# Altium project DIOT_EEM_Adapter.PrjPCB (part 1 of 2)
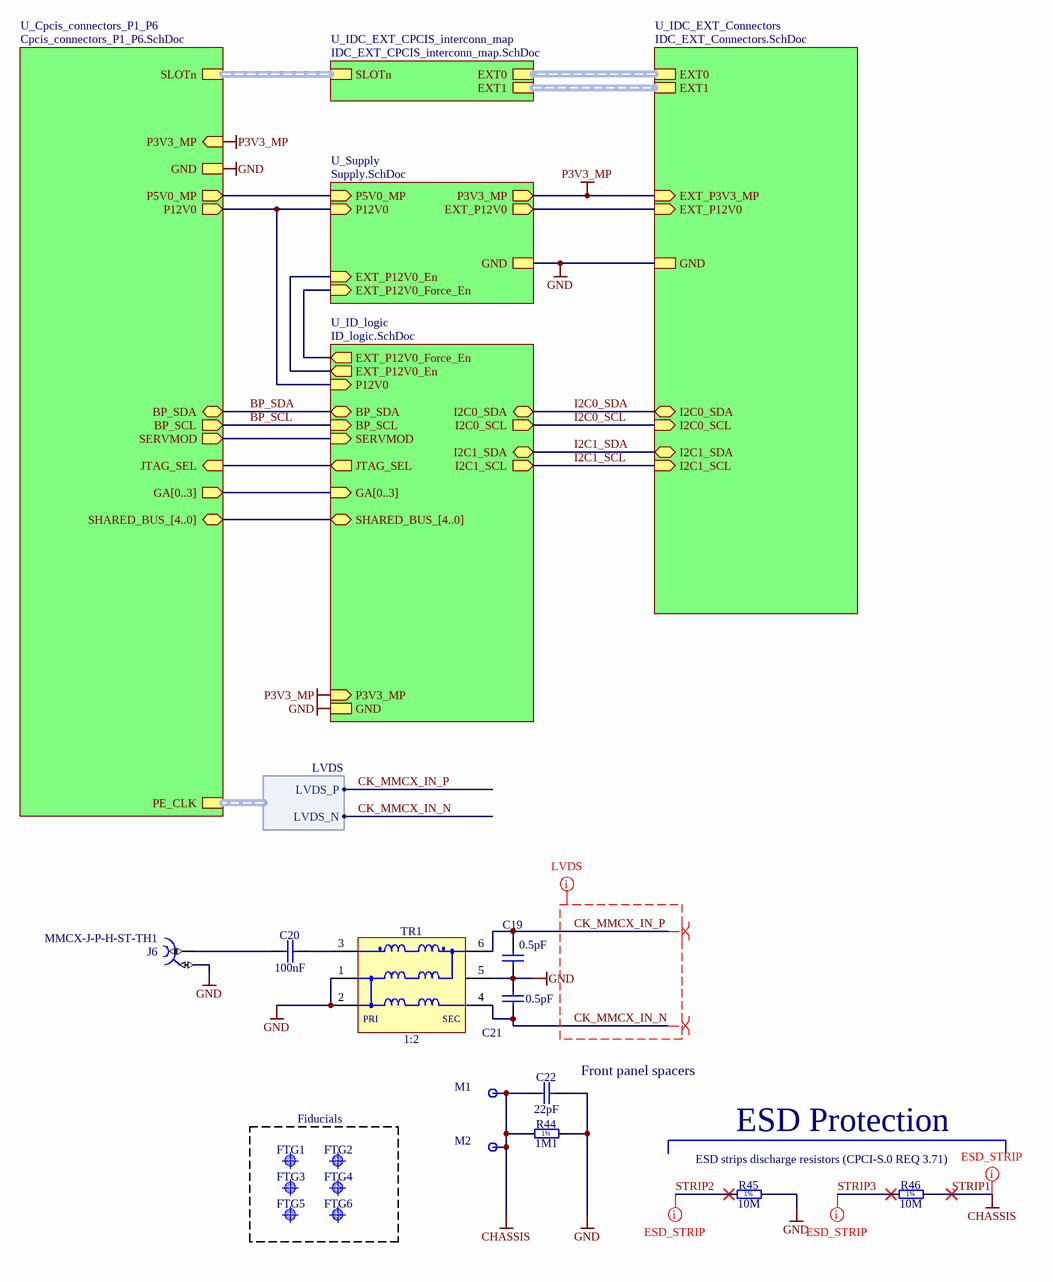
[diagram p0: DIOT_EEM_Adapter.SchDoc]
Address1: Warsaw University of Technology; Address2: Nowowiejska 15/19 00-665 Warsaw; Address3: -; CheckedBy: -; CheckedDate: -; Designer: Marcin Kiepiela; DivGrp: ISE; DrawnBy: Marcin Kiepiela; Project1: DIOT_EEM_Adapter; Projet: ARTIQ/Sinara/DIOT; SheetTotal: 6; Title: DIOT_EEM_Adapter; Version: 1.0
6 sheets, 144 parts. Net scope: strictly hierarchical (ports join the sheet entries above them; power ports are local).
Board file: DIOT_EEM_Adapter.pcbdoc
Sheets:
  DIOT_EEM_Adapter.SchDoc
    U_ID_logic = ID_logic.SchDoc
    U_IDC_EXT_Connectors = IDC_EXT_Connectors.SchDoc
    U_Cpcis_connectors_P1_P6 = Cpcis_connectors_P1_P6.SchDoc
    U_Supply = Supply.SchDoc
    U_IDC_EXT_CPCIS_interconn_map = IDC_EXT_CPCIS_interconn_map.SchDoc

## Sheet DIOT_EEM_Adapter.SchDoc: DIOT_EEM_Adapter
size 420 x 297 mm; CheckedBy: -; DrawnBy: Marcin Kiepiela; Address1: Warsaw University of Technology; Address2: Nowowiejska 15/19 00-665 Warsaw; DocumentNumber: 1; SheetNumber: 1; SheetTotal: 6; EDA_Number: ARTIQ; Projet: ARTIQ/Sinara/DIOT; ModifiedBy: -; CheckedDate: -; Title2: -; DivGrp: ISE; Designer: Marcin Kiepiela; ModifiedDate: -; ProjectName: DIOT_EEM_Adapter.PrjPCB

### Parts
C19  0.5pF  [CAPC1005X50N]
C20  100nF  [CAPC1005X55N]
C21  0.5pF  [CAPC1005X50N]
C22  22pF  [CAPC1005X55N]
FTG1  Use only in PCB  [FIDUCIAL_TOP_S100-200]  (value not drawn)  (no BOM)
FTG2  Use only in PCB  [FIDUCIAL_TOP_S100-200]  (value not drawn)  (no BOM)
FTG3  Use only in PCB  [FIDUCIAL_TOP_S100-200]  (value not drawn)  (no BOM)
FTG4  Use only in PCB  [FIDUCIAL_TOP_S100-200]  (value not drawn)  (no BOM)
FTG5  Use only in PCB  [FIDUCIAL_TOP_S100-200]  (value not drawn)  (no BOM)
FTG6  Use only in PCB  [FIDUCIAL_TOP_S100-200]  (value not drawn)  (no BOM)
J6  MMCX-J-P-H-ST-TH1  [SAMTEC_MMCX-J-P-H-ST-TH1]
M1  Plated Hole  [MTG300_600]  (value not drawn)  (no BOM)
M2  Plated Hole  [MTG300_600]  (value not drawn)  (no BOM)
R44  1M1  [RESC2012X60N]
R45  10M  [RESC2113X55N]
R46  10M  [RESC2113X55N]
TR1  1:2  [XFMR_MINI-CIRCUITS_DB1627]

### Blocks framed on the sheet
Fiducials: FTG1-FTG6

### Sub-sheets
U_Cpcis_connectors_P1_P6 = Cpcis_connectors_P1_P6.SchDoc: SLOTn (harness SLOT), BP_SDA (bidir), BP_SCL (out), SHARED_BUS_[4..0] (bidir), GND, P5V0_MP (out), P12V0 (out), PE_CLK (harness LVDS), GA[0..3] (out), P3V3_MP (in), JTAG_SEL (in), SERVMOD (out)
U_ID_logic = ID_logic.SchDoc: BP_SCL (in), BP_SDA (bidir), I2C0_SDA (bidir), I2C0_SCL (out), I2C1_SDA (bidir), I2C1_SCL (out), GND, P3V3_MP (in), GA[0..3] (in), JTAG_SEL (out), EXT_P12V0_En (out), SERVMOD (in), EXT_P12V0_Force_En (out), P12V0 (in), SHARED_BUS_[4..0] (bidir)
U_IDC_EXT_Connectors = IDC_EXT_Connectors.SchDoc: EXT0 (harness ExtensionConnector), EXT1 (harness ExtensionConnector), I2C0_SDA (bidir), I2C0_SCL (in), I2C1_SDA (bidir), I2C1_SCL (in), EXT_P12V0 (in), EXT_P3V3_MP (in), GND
U_IDC_EXT_CPCIS_interconn_map = IDC_EXT_CPCIS_interconn_map.SchDoc: EXT0 (harness ExtensionConnector), EXT1 (harness ExtensionConnector), SLOTn (harness SLOT)
U_Supply = Supply.SchDoc: EXT_P12V0 (out), P3V3_MP (out), GND, P5V0_MP (in), P12V0 (in), EXT_P12V0_En (in), EXT_P12V0_Force_En (in)

### Harnesses
LVDS: LVDS_P, LVDS_N

### Nets
CHASSIS: C22.1 M1.1 M2.1 R44.1 R46.2  [also labelled STRIP1]
EXT_P12V0: sheet U_IDC_EXT_Connectors/EXT_P12V0, sheet U_Supply/EXT_P12V0
GND: C19.1 C21.2 C22.2 J6.2 R44.2 R45.2 TR1.1(P1) TR1.2(P1) TR1.5(NC) ; sheet U_ID_logic/GND, sheet U_IDC_EXT_Connectors/GND, sheet U_Cpcis_connectors_P1_P6/GND, sheet U_Supply/GND
P3V3_MP: sheet U_ID_logic/P3V3_MP, sheet U_IDC_EXT_Connectors/EXT_P3V3_MP, sheet U_Cpcis_connectors_P1_P6/P3V3_MP, sheet U_Supply/P3V3_MP
P5V0_MP: sheet U_Cpcis_connectors_P1_P6/P5V0_MP, sheet U_Supply/P5V0_MP
P12V0: sheet U_ID_logic/P12V0, sheet U_Cpcis_connectors_P1_P6/P12V0, sheet U_Supply/P12V0
BP_SCL: sheet U_ID_logic/BP_SCL, sheet U_Cpcis_connectors_P1_P6/BP_SCL
BP_SDA: sheet U_ID_logic/BP_SDA, sheet U_Cpcis_connectors_P1_P6/BP_SDA
CK_MMCX_IN_N: C21.1 TR1.4(S1) ; sheet U_Cpcis_connectors_P1_P6/PE_CLK.LVDS_N
CK_MMCX_IN_P: C19.2 TR1.6(S1) ; sheet U_Cpcis_connectors_P1_P6/PE_CLK.LVDS_P
EEM_P12V0_En: sheet U_ID_logic/EXT_P12V0_En, sheet U_Supply/EXT_P12V0_En
EXT_P12V0_Force_En: sheet U_ID_logic/EXT_P12V0_Force_En, sheet U_Supply/EXT_P12V0_Force_En
I2C0_SCL: sheet U_ID_logic/I2C0_SCL, sheet U_IDC_EXT_Connectors/I2C0_SCL
I2C0_SDA: sheet U_ID_logic/I2C0_SDA, sheet U_IDC_EXT_Connectors/I2C0_SDA
I2C1_SCL: sheet U_ID_logic/I2C1_SCL, sheet U_IDC_EXT_Connectors/I2C1_SCL
I2C1_SDA: sheet U_ID_logic/I2C1_SDA, sheet U_IDC_EXT_Connectors/I2C1_SDA
JTAG_SEL: sheet U_ID_logic/JTAG_SEL, sheet U_Cpcis_connectors_P1_P6/JTAG_SEL
SERVMOD: sheet U_ID_logic/SERVMOD, sheet U_Cpcis_connectors_P1_P6/SERVMOD
STRIP2: R45.1  [project net STRIP2_1]
STRIP3: R46.1  [project net STRIP3_1]
NetC20_1: C20.1 J6.1
NetC20_2: C20.2 TR1.3(P1)

### Buses and harness runs
bus sheet U_Cpcis_connectors_P1_P6/GA[0..3] = sheet U_ID_logic/GA[0..3]
bus sheet U_Cpcis_connectors_P1_P6/SHARED_BUS_[4..0] = sheet U_ID_logic/SHARED_BUS_[4..0]
harness sheet U_Cpcis_connectors_P1_P6/SLOTn = sheet U_IDC_EXT_CPCIS_interconn_map/SLOTn
harness sheet U_IDC_EXT_Connectors/EXT0 = sheet U_IDC_EXT_CPCIS_interconn_map/EXT0
harness sheet U_IDC_EXT_Connectors/EXT1 = sheet U_IDC_EXT_CPCIS_interconn_map/EXT1

### Layout directives
differential pair: CK_MMCX_IN_N, CK_MMCX_IN_P
net class LVDS: CK_MMCX_IN_N, CK_MMCX_IN_P
net class ESD_STRIP: CHASSIS, STRIP2_1, STRIP3_1

### Notes on the sheet
- (near C22) Front panel spacers
- ESD strips discharge resistors (CPCI-S.0 REQ 3.71)
- ESD Protection
- Project/Equipment
- Document
- Designer
- Drawn by
- Check.by
- Copyright WUT 2023.
  This document describes Open Hardware and is licensed under the CERN-OHL-W v2
  You may redistribute and modify this documentation and make products using it under the terms of the CERN-OHL-W v2 (https:/cern.ch/cern-ohl). This documentation is distributed WITHOUT ANY EXPRESS OR IMPLIED WARRANTY, INCLUDING OF MERCHANTABILITY, SATISFACTORY QUALITY AND FITNESS FOR A PARTICULAR PURPOSE. Please see the CERN-OHL-W v2 for applicable conditions.
  Source location: https://github.com/sinara-hw/EEM_FMC_Carrier
  As per CERN-OHL-W v2 section 4, should You produce hardware based on these sources, You must maintain the Source Location visible on the silkscreen or top copper for a EEM FMC Carrier PCB or other product you make using this documentation.
- Contact:
- File
- Last Mod.
- Print Date
- Sheet
- Size
- A3
- of
- Rev
- (in symbol R0805_1M1_1%_0.125W_100PPM) 1%
- (in symbol R0805_10M_1%_0.125W_100PPM_VISHAY_CRCW e3) 1%
- (in symbol XFMR_MINI-CIRCUITS_TCM2-43X+) PRI; SEC

### Library data of the parts
C19 C21 = CC0402_0.5PF_25V_0.05PF_AVX_04023J0R5ABSTR: Non-polarised capacitor; Part Description: Thin-Film Chip Capacitors for RF Signal and Power Applications, Accu-P Series; Manufacturer: AVX; Voltage: 25V; Tolerance: ±0.05pF; Part Number: CC0402_0.5PF_25V_0.05PF_AVX_04023J0R5ABSTR; Component Kind: Standard; Component Type: Standard; Pin Count: 2; Value: 0.5pF; Status: None; Manufacturer Part Number: 04023J0R5ABSTR; Case: 0402; Mounted: Yes; Socket: No; SMD: Yes; Sense: No; ComponentHeight: 0.5mm; HelpURL: \\cern.ch\dfs\Applications\Altium\Datasheets\CC0402_AVX_ACCU-P.pdf; Author: CERN DEM JLC; CreateDate: 2017-02-22; LatestRevisionDate: 2017-02-22
C20 = CC0402_100NF_16V_10%_X7R: Non-polarised capacitor; Part Description: SMD Multilayer Chip Ceramic Capacitor; Manufacturer: GENERIC; Manufacturer1 Part Number: GRM155R71C104KA88D; Voltage: 16V; TC: X7R; Tolerance: ±10%; Part Number: CC0402_100NF_16V_10%_X7R; Component Kind: Standard; Component Type: Standard; Pin Count: 2; Value: 100nF; Status: Not Recommended; Manufacturer Part Number: CC0402_100NF_16V_10%_X7R; Case: 0402; Mounted: Yes; Socket: No; SMD: Yes; Sense: No; Manufacturer1 Example: MURATA; Manufacturer1 ComponentHeight: 0.55mm; HelpURL: \\cern.ch\dfs\Applications\Altium\Datasheets\CC0402_X7R_MURATA_GRM.pdf; Author: CERN DEM JLC; CreateDate: 05.12.2013; LatestRevisionDate: 03.12.2007
C22 = CC0402_22PF_50V_5%_C0G: Non-polarised capacitor; Part Description: SMD Multilayer Chip Ceramic Capacitor; Manufacturer: GENERIC; Manufacturer1 Part Number: C0402C220J5GACTU; Voltage: 50V; TC: C0G/NP0; Tolerance: ±5%; Part Number: CC0402_22PF_50V_5%_C0G; Component Kind: Standard; Component Type: Standard; Pin Count: 2; Value: 22pF; Status: Preferred; Manufacturer Part Number: CC0402_22PF_50V_5%_C0G; Case: 0402; Mounted: Yes; Socket: No; SMD: Yes; Manufacturer1 Example: KEMET; Manufacturer1 ComponentHeight: 0.55mm; HelpURL: \\cern.ch\dfs\Applications\Altium\Datasheets\CC0402_C0G_KEMET_(Commercial Grade).pdf; Author: CERN DEM JLC; CreateDate: 2007-12-03; LatestRevisionDate: 2007-12-03; Sense: No
FTG1-FTG6 = FIDUCIAL_TARGET_S100-200: Fiducial Target; Part Description: Square Fiducial Target, Top Layer, 1.0mm, Top Solder 2.0mm, Keepout =2.0mm; Mounted: No; Part Number: FIDUCIAL_TARGET_S100-200; Component Type: Standard (No BOM); Pin Count: 1; Family: Fiducial; Socket: No; SMD: Yes; Status: None; ComponentHeight: 0mm; Author: CERN DEM JLC; CreateDate: 2010-02-09; LatestRevisionDate: 2012-04-04; PackageDescription: Square Fiducial Target, Top Layer, 1.0mm, Top Solder 2.0mm, Keepout =2.0mm; HelpURL: Undefined; Sense: No
J6 = SAMTEC_MMCX-J-P-H-ST-TH1: Part Description: Straight Through-hole 50 Ohm Micro Mini RF Jack, MMCX Series; Manufacturer: SAMTEC; PressFit: No; Part Number: SAMTEC_MMCX-J-P-H-ST-TH1; Component Kind: Standard; Component Type: Standard; Pin Count: 2; Mounted: Yes; Socket: No; Sense: No; SMD: No; Status: None; Manufacturer Part Number: MMCX-J-P-H-ST-TH1; ComponentHeight: 4.35mm; HelpURL: \\cern.ch\dfs\Applications\Altium\Datasheets\SAMTEC_MMCX-J-P-H-ST-TH1.pdf; Author: CERN DEM JLC; CreateDate: 05.12.2012; LatestRevisionDate: 05.12.2012
M1 M2 = PLATED_HOLE3.0_PAD6.0: Single Terminal Socket; Part Description: Plated Through Hole: Hole Dia.=3.0mm Pad Dia.=6.0mm; Mounted: No; Table: Pads; Part Number: PLATED_HOLE3.0_PAD6.0; Component Type: Standard (No BOM); Designator: Single Terminal Socket; Library Reference: Single Terminal Socket; Pin Count: 1; Family: Plated Hole; Socket: No; SMD: No; Status: None; ComponentHeight: 0mm; Author: CERN DEM JLC; CreateDate: 26.05.2008; LatestRevisionDate: 26.05.2008; PackageDescription: Plated Through Hole: Hole Dia.=3.0mm Pad Dia.=6.0mm
R44 = R0805_1M1_1%_0.125W_100PPM: Resistor - 1%; Part Description: General Purpose Thick Film Chip Resistor; Manufacturer: GENERIC; Manufacturer1 Part Number: NRC10F1104TRF; Power: 0.125W; TC: ±100ppm/°C; PressFit: No; Part Number: R0805_1M1_1%_0.125W_100PPM; Component Kind: Standard; Component Type: Standard; Pin Count: 2; Value: 1M1; Status: Preferred; Tolerance: ±1%; Manufacturer Part Number: R0805_1M1_1%_0.125W_100PPM; Case: 0805; Mounted: Yes; Sense: No; Socket: No; SMD: Yes; Manufacturer1 Example: NIC COMPONENT; Manufacturer1 ComponentHeight: 0.6mm; HelpURL: \\cern.ch\dfs\Applications\Altium\Datasheets\R0805_NIC_NRC.pdf; Author: CERN DEM JLC; CreateDate: 03/12/2007; LatestRevisionDate: 13/03/2008
R45 R46 = R0805_10M_1%_0.125W_100PPM_VISHAY_CRCW e3: Resistor - 1%; Part Description: 150V, Standard Thick Film Chip Resistor; Manufacturer: VISHAY DALE; Manufacturer Part Number: CRCW080510M0FKEA; Power: 0.125W; TC: ±100ppm/°C; PressFit: No; Part Number: R0805_10M_1%_0.125W_100PPM_VISHAY_CRCW e3; Component Kind: Standard; Component Type: Standard; Pin Count: 2; Value: 10M; Status: None; Tolerance: ±1%; Case: 0805; Mounted: Yes; Sense: No; Socket: No; SMD: Yes; ComponentHeight: 0.5mm; HelpURL: \\cern.ch\dfs\Applications\Altium\Datasheets\R0805_VISHAY_CRCW e3.pdf; Author: CERN DEM BC; CreateDate: 2019-11-12; LatestRevisionDate: 2019-11-12
TR1 = XFMR_MINI-CIRCUITS_TCM2-43X+: 50 OHMS 10 to 4000 MHz RF Transformer; Power: 0.4W; Part Number: XFMR_MINI-CIRCUITS_TCM2-43X+; Component Kind: Standard; Component Type: Standard; Pin Count: 6; Value: 1:2; Status: None; Part Description: 50 Ohms 10 to 4000MHz RF Transformer; Manufacturer: MINI-CIRCUITS; Manufacturer Part Number: TCM2-43X+; Mounted: Yes; Socket: No; Sense: No; SMD: Yes; ComponentHeight: 4.06mm; HelpURL: \\cern.ch\dfs\Applications\Altium\Datasheets\XFMR_MINI-CIRCUITS_TCM2-43X+.pdf; Author: CERN DEM BC; CreateDate: 2016-02-12; LatestRevisionDate: 2016-02-12

## Sheet ID_logic.SchDoc: DIOT_EEM_Adapter
size 420 x 297 mm; CheckedBy: -; DrawnBy: Marcin Kiepiela; Address1: Warsaw University of Technology; Address2: Nowowiejska 15/19 00-665 Warsaw; DocumentNumber: 3; SheetNumber: 3; SheetTotal: 6; EDA_Number: ARTIQ; Projet: ARTIQ/Sinara/DIOT; ModifiedBy: -; CheckedDate: -; Title2: -; DivGrp: ISE; Designer: Marcin Kiepiela; ModifiedDate: -; ProjectName: DIOT_EEM_Adapter.PrjPCB
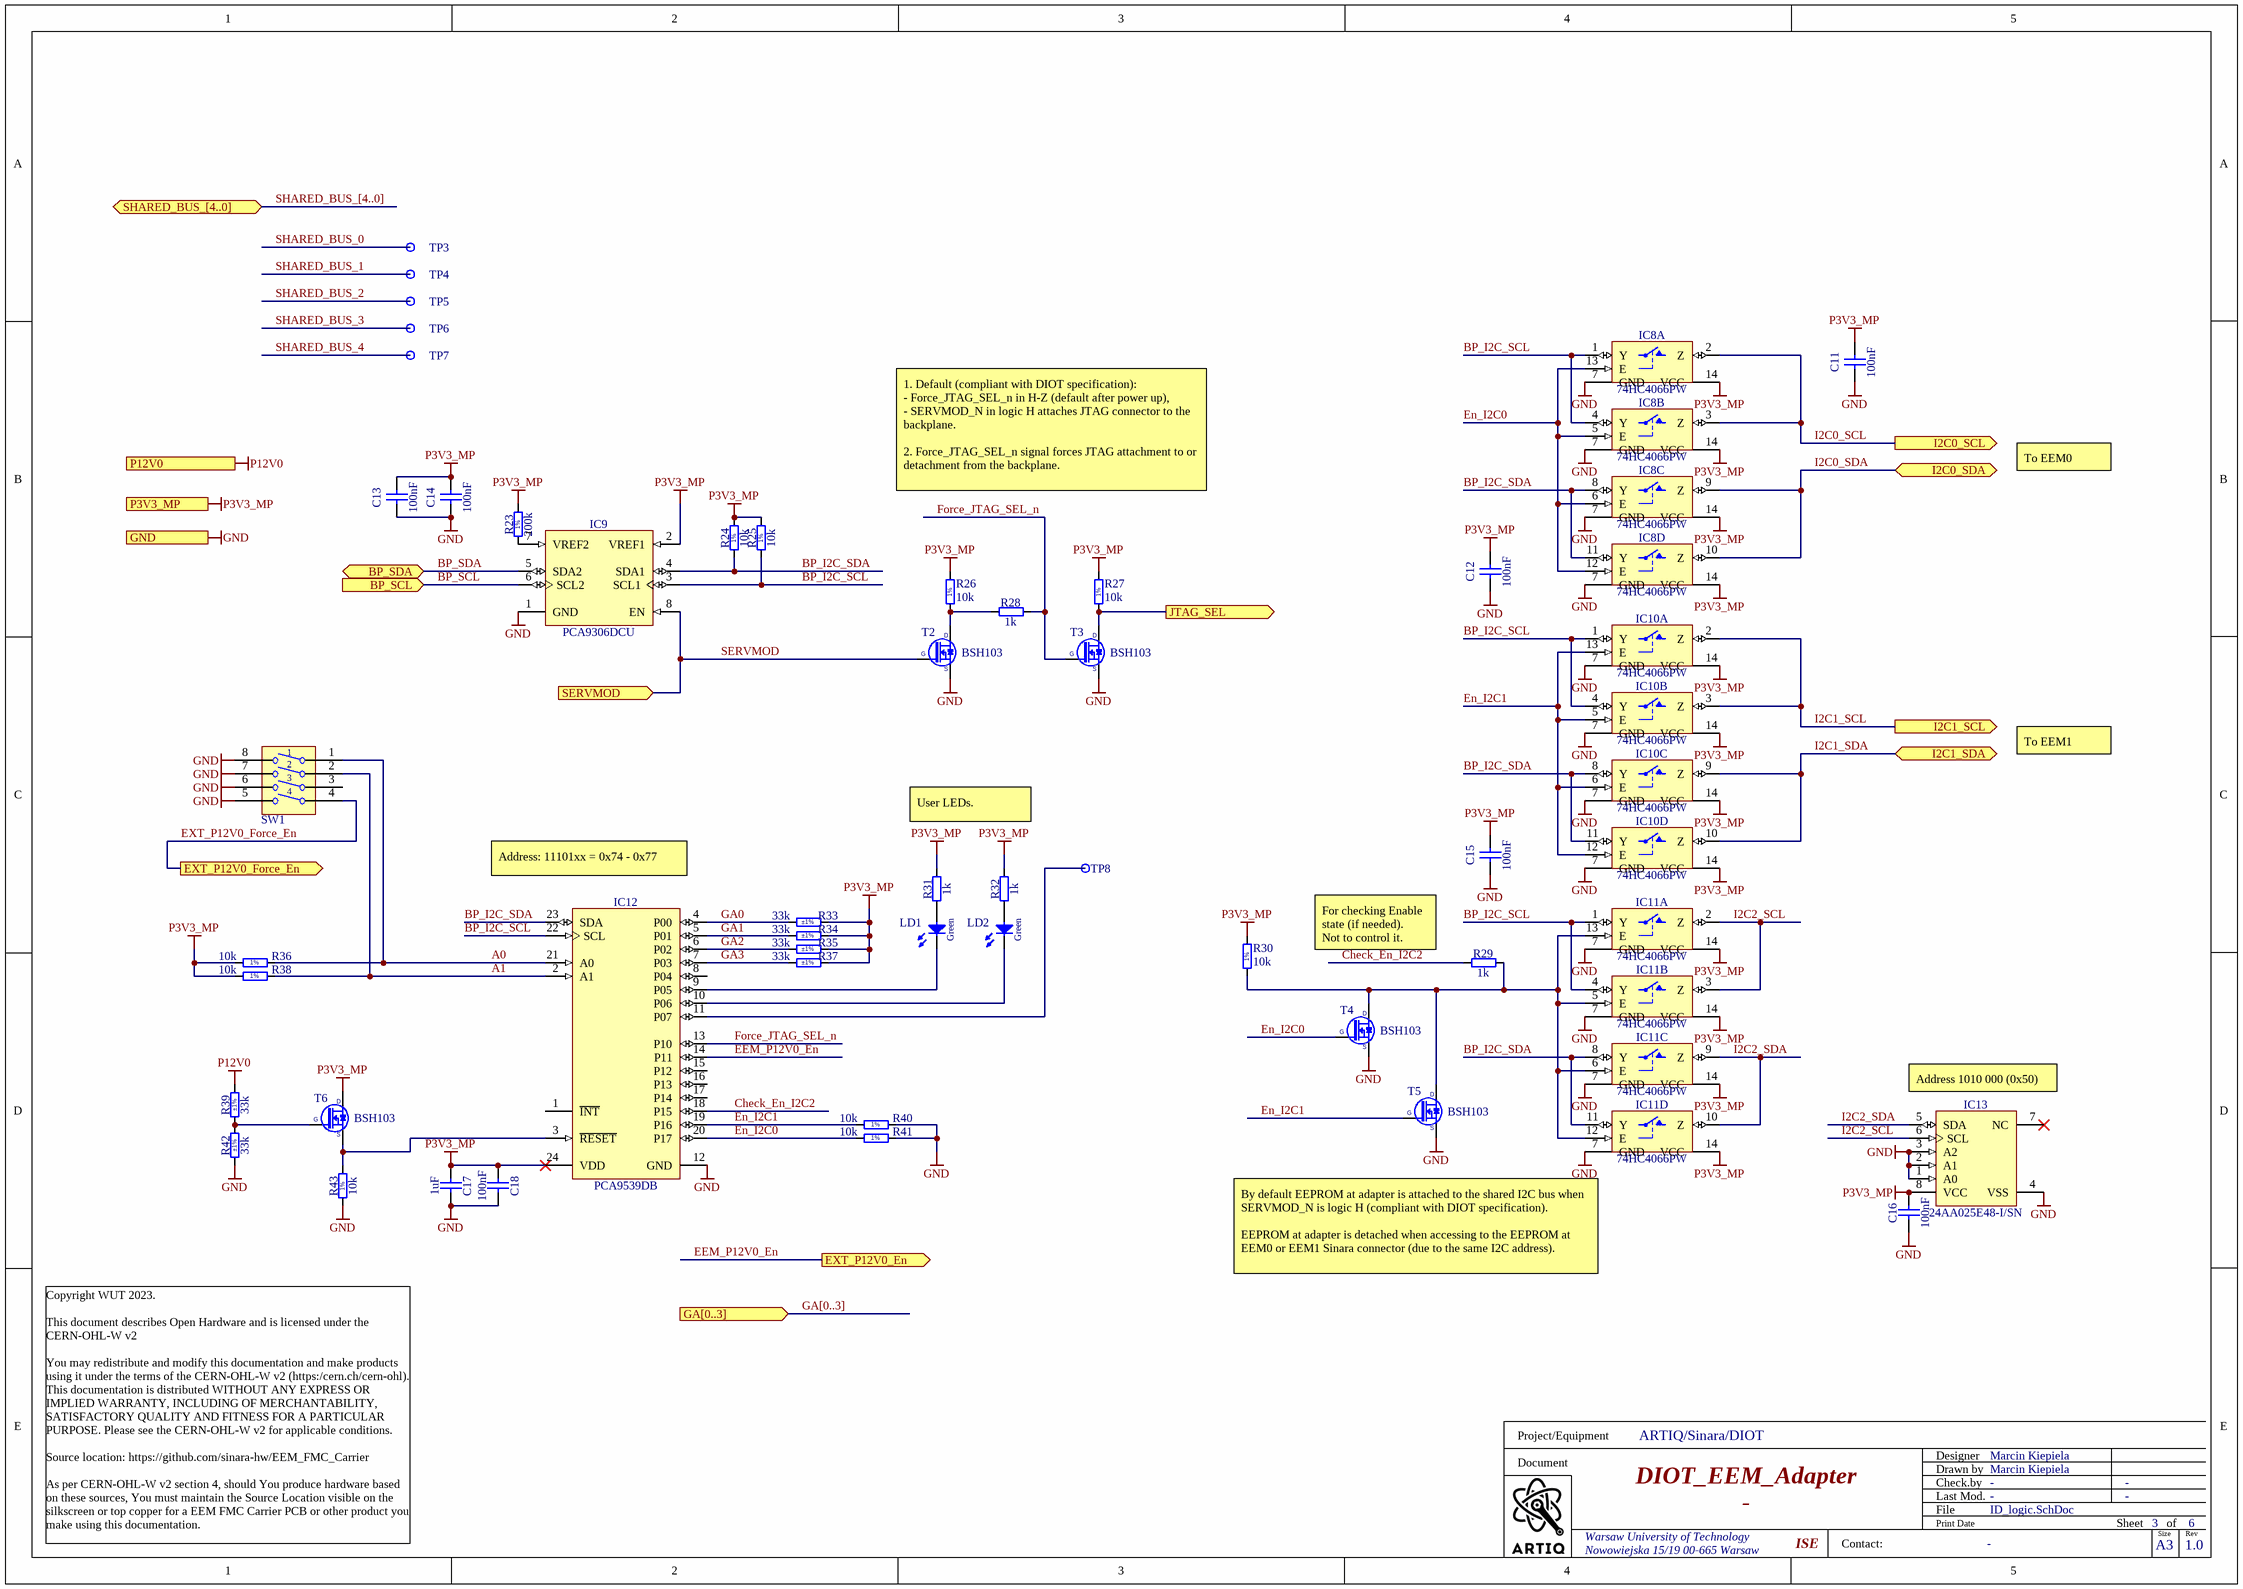
[diagram p1: ID_logic.SchDoc]

### Parts
C11  100nF  [CAPC1005X55N]
C12  100nF  [CAPC1005X55N]
C13  100nF  [CAPC1005X55N]
C14  100nF  [CAPC1005X55N]
C15  100nF  [CAPC1005X55N]
C16  100nF  [CAPC1005X55N]
C17  1uF  [CAPC1608X87N]
C18  100nF  [CAPC1005X55N]
IC8  74HC4066PW  [SOP65P640X110-14N]  (parts A,B,C,D of 4)
IC9  PCA9306DCU  [SOP50P310X90-8N]
IC10  74HC4066PW  [SOP65P640X110-14N]  (parts A,B,C,D of 4)
IC11  74HC4066PW  [SOP65P640X110-14N]  (parts A,B,C,D of 4)
IC12  PCA9539DB  [SOP65P780X200-24N]
IC13  24AA025E48-I/SN  [SOIC127P600X175-8N]
LD1  Green  [LED_KINGBRIGHT_KPH-1608CGCK]
LD2  Green  [LED_KINGBRIGHT_KPH-1608CGCK]
R23  200k  [RESC1005X40N]
R24  10k  [RESC1005X40N]
R25  10k  [RESC1005X40N]
R26  10k  [RESC1005X40N]
R27  10k  [RESC1005X40N]
R28  1k  [RESC1005X40N]
R29  1k  [RESC1005X40N]
R30  10k  [RESC1005X40N]
R31  1k  [RESC1005X40N]
R32  1k  [RESC1005X40N]
R33  33k  Tolerance: ±1%  [RESC1005X40N]
R34  33k  Tolerance: ±1%  [RESC1005X40N]
R35  33k  Tolerance: ±1%  [RESC1005X40N]
R36  10k  [RESC1005X40N]
R37  33k  Tolerance: ±1%  [RESC1005X40N]
R38  10k  [RESC1005X40N]
R39  33k  Tolerance: ±1%  [RESC1005X40N]
R40  10k  [RESC1005X40N]
R41  10k  [RESC1005X40N]
R42  33k  Tolerance: ±1%  [RESC1005X40N]
R43  10k  [RESC1005X40N]
SW1  Switch  [SW_OMRON_A6S-4102-H]  (value not drawn)
T2  BSH103  [SOT95P230X110-3N]
T3  BSH103  [SOT95P230X110-3N]
T4  BSH103  [SOT95P230X110-3N]
T5  BSH103  [SOT95P230X110-3N]
T6  BSH103  [SOT95P230X110-3N]
TP3  Test Point  [TPS127]  (value not drawn)
TP4  Test Point  [TPS127]  (value not drawn)
TP5  Test Point  [TPS127]  (value not drawn)
TP6  Test Point  [TPS127]  (value not drawn)
TP7  Test Point  [TPS127]  (value not drawn)
TP8  Test Point  [TPS127]  (value not drawn)

### Ports
BP_SCL (in), BP_SDA (bidir), EXT_P12V0_En (out), EXT_P12V0_Force_En (out), GA[0..3] (in), GND, I2C0_SCL (out), I2C0_SDA (bidir), I2C1_SCL (out), I2C1_SDA (bidir), JTAG_SEL (out), P3V3_MP (in), P12V0 (in), SERVMOD (in), SHARED_BUS_[4..0] (bidir)

### Nets
GND: C11.1 C12.1 C13.1 C14.1 C15.1 C16.1 C17.1 C18.1 IC8.7(GND) IC9.1(GND) IC10.7(GND) IC11.7(GND) IC12.12(GND) IC13.1(A0) IC13.2(A1) IC13.3(A2) IC13.4(VSS) R40.2 R41.2 R42.1 R43.1 SW1.5 SW1.6 SW1.7 SW1.8 T2.2(S) T3.2(S) T4.2(S) T5.2(S) ; port GND
P3V3_MP: C11.2 C12.2 C13.2 C14.2 C15.2 C16.2 C17.2 C18.2 IC8.14(VCC) IC9.2(VREF1) IC10.14(VCC) IC11.14(VCC) IC12.24(VDD) IC13.8(VCC) R23.2 R24.2 R25.2 R26.2 R27.2 R30.2 R31.2 R32.2 R33.2 R34.2 R35.2 R36.1 R37.2 R38.1 T6.3(D) ; port P3V3_MP
P12V0: R39.2 ; port P12V0
A0: IC12.21(A0) R36.2 SW1.1  [project net A0_3]
A1: IC12.2(A1) R38.2 SW1.2  [project net A1_3]
BP_I2C_SCL: IC8.1(Y) IC8.4(Y) IC9.3(SCL1) IC10.1(Y) IC10.4(Y) IC11.1(Y) IC11.4(Y) IC12.22(SCL) R25.1  [project net BP_I2C_SCL_3]
BP_I2C_SDA: IC8.8(Y) IC8.11(Y) IC9.4(SDA1) IC10.8(Y) IC10.11(Y) IC11.8(Y) IC11.11(Y) IC12.23(SDA) R24.1  [project net BP_I2C_SDA_3]
BP_SCL: IC9.6(SCL2) ; port BP_SCL
BP_SDA: IC9.5(SDA2) ; port BP_SDA
Check_En_I2C2: IC12.18(P15) R29.1  [project net Check_En_I2C2_3]
EEM_P12V0_En: IC12.14(P11) ; port EXT_P12V0_En
En_I2C0: IC8.5(E) IC8.6(E) IC8.12(E) IC8.13(E) IC12.20(P17) R41.1 T4.1(G)  [project net En_I2C0_3]
En_I2C1: IC10.5(E) IC10.6(E) IC10.12(E) IC10.13(E) IC12.19(P16) R40.1 T5.1(G)  [project net En_I2C1_3]
EXT_P12V0_Force_En: SW1.4 ; port EXT_P12V0_Force_En
Force_JTAG_SEL_n: IC12.13(P10) R28.2 T3.1(G)  [project net Force_JTAG_SEL_n_3]
GA0: IC12.4(P00) R33.1
GA1: IC12.5(P01) R34.1
GA2: IC12.6(P02) R35.1
GA3: IC12.7(P03) R37.1
I2C0_SCL: IC8.2(Z) IC8.3(Z) ; port I2C0_SCL
I2C0_SDA: IC8.9(Z) IC8.10(Z) ; port I2C0_SDA
I2C1_SCL: IC10.2(Z) IC10.3(Z) ; port I2C1_SCL
I2C1_SDA: IC10.9(Z) IC10.10(Z) ; port I2C1_SDA
I2C2_SCL: IC11.2(Z) IC11.3(Z) IC13.6(SCL)  [project net I2C2_SCL_3]
I2C2_SDA: IC11.9(Z) IC11.10(Z) IC13.5(SDA)  [project net I2C2_SDA_3]
JTAG_SEL: R27.1 T3.3(D) ; port JTAG_SEL
SERVMOD: IC9.8(EN) T2.1(G) ; port SERVMOD
SHARED_BUS_0: TP3.1
SHARED_BUS_1: TP4.1
SHARED_BUS_2: TP5.1
SHARED_BUS_3: TP6.1
SHARED_BUS_4: TP7.1
NetIC9_7: IC9.7(VREF2) R23.1
NetIC11_5: IC11.5(E) IC11.6(E) IC11.12(E) IC11.13(E) R29.2 R30.1 T4.3(D) T5.3(D)
NetIC12_3: IC12.3(~{RESET}) R43.2 T6.2(S)
NetIC12_9: IC12.9(P05) LD1.1(C)
NetIC12_10: IC12.10(P06) LD2.1(C)
NetIC12_11: IC12.11(P07) TP8.1
NetLD1_2: LD1.2(A) R31.1
NetLD2_2: LD2.2(A) R32.1
NetR26_1: R26.1 R28.1 T2.3(D)
NetR39_1: R39.1 R42.2 T6.1(G)

Not connected (* = marked no-connect by the designer): IC12 1(~{INT}) 8(P04) 15(P12) 16(P13) 17(P14); IC13 7(NC)*; SW1 3

### Buses and harness runs
bus GA[0..3] = port GA[0..3]
bus SHARED_BUS_[4..0] = port SHARED_BUS_[4..0]

### Notes on the sheet
- 1. Default (compliant with DIOT specification):
  - Force_JTAG_SEL_n in H-Z (default after power up),
  - SERVMOD_N in logic H attaches JTAG connector to the backplane.
  2. Force_JTAG_SEL_n signal forces JTAG attachment to or detachment from the backplane.
- To EEM0
- To EEM1
- User LEDs.
- (near IC12) Address: 11101xx = 0x74 - 0x77
- (near R29) For checking Enable state (if needed).
  Not to control it.
- (near IC13) Address 1010 000 (0x50)
- (near IC11) By default EEPROM at adapter is attached to the shared I2C bus when SERVMOD_N is logic H (compliant with DIOT specification).
  EEPROM at adapter is detached when accessing to the EEPROM at EEM0 or EEM1 Sinara connector (due to the same I2C address).
- Project/Equipment
- Document
- Designer
- Drawn by
- Check.by
- Copyright WUT 2023.
  This document describes Open Hardware and is licensed under the CERN-OHL-W v2
  You may redistribute and modify this documentation and make products using it under the terms of the CERN-OHL-W v2 (https:/cern.ch/cern-ohl). This documentation is distributed WITHOUT ANY EXPRESS OR IMPLIED WARRANTY, INCLUDING OF MERCHANTABILITY, SATISFACTORY QUALITY AND FITNESS FOR A PARTICULAR PURPOSE. Please see the CERN-OHL-W v2 for applicable conditions.
  Source location: https://github.com/sinara-hw/EEM_FMC_Carrier
  As per CERN-OHL-W v2 section 4, should You produce hardware based on these sources, You must maintain the Source Location visible on the silkscreen or top copper for a EEM FMC Carrier PCB or other product you make using this documentation.
- Contact:
- File
- Last Mod.
- Print Date
- Sheet
- Size
- A3
- of
- Rev
- (in symbol R0402_10K_1%_0.0625W_100PPM) 1%
- (in symbol R0402_200K_1%_0.0625W_100PPM) 1%

### Library data of the parts
C11-C16 C18 = CC0402_100NF_16V_10%_X7R: as C20 on sheet DIOT_EEM_Adapter; Part Number: CC0402_100NF_16V_10%_X7R; Component Kind: Standard; Component Type: Standard; Pin Count: 2; Value: 100nF; Status: Not Recommended; Manufacturer Part Number: CC0402_100NF_16V_10%_X7R; Case: 0402; Mounted: Yes; Socket: No; SMD: Yes; Sense: No; HelpURL: \\cern.ch\dfs\Applications\Altium\Datasheets\CC0402_X7R_MURATA_GRM.pdf; Author: CERN DEM JLC; CreateDate: 05.12.2013; LatestRevisionDate: 03.12.2007; Manufacturer1 Example: MURATA; Manufacturer1 ComponentHeight: 0.55mm
C17 = CC0603_1UF_25V_10%_X7R: Non-polarised capacitor; Part Description: SMD Multilayer Chip Ceramic Capacitor; Manufacturer: GENERIC; Manufacturer1 Part Number: GRM188R71E105KA12D; Voltage: 25V; TC: X7R; Tolerance: ±10%; Part Number: CC0603_1UF_25V_10%_X7R; Component Kind: Standard; Component Type: Standard; Pin Count: 2; Value: 1uF; Status: None; Manufacturer Part Number: CC0603_1UF_25V_10%_X7R; Case: 0603; Mounted: Yes; Socket: No; SMD: Yes; Sense: No; Manufacturer1 Example: MURATA; Manufacturer1 ComponentHeight: 0.9mm; HelpURL: \\cern.ch\dfs\Applications\Altium\Datasheets\CC0603_X7R_MURATA.pdf; Author: CERN DEM JLC; CreateDate: 18.01.2011; LatestRevisionDate: 18.01.2011
IC8 IC10 IC11 = 74HC4066PW: Part Description: Quad Single-Pole Single-Throw Analog Switch; Manufacturer: NXP SEMICONDUCTORS; PressFit: No; Bonding: No; Part Number: 74HC4066PW; Component Kind: Standard; Component Type: Standard; Device: 74HC4066PW; PackageDescription: SOP, 14-Leads, Body 4.4x5mm (max), Pitch 0.65mm, IPC Medium Density; Manufacturer Part Number: 74HC4066PW; Pin Count: 14; Case: TSSOP14; Mounted: Yes; Socket: No; SMD: Yes; Sense: No; ComponentHeight: 1.1mm; Author: CERN DEM JLC; HelpURL: \\cern.ch\dfs\Applications\Altium\Datasheets\74HC4066PW.pdf; CreateDate: 19.11.2014; LatestRevisionDate: 19.11.2014
IC9 = PCA9306DCUR: Dual Bidirectional I2C Bus And SMBus Voltage-Level Translator; Manufacturer: TEXAS INSTRUMENTS; PressFit: No; Bonding: No; Part Number: PCA9306DCUR; Component Kind: Standard; Component Type: Standard; Device: PCA9306DCU; PackageDescription: SOP, 0.50mm Pitch; 8 pin, 2.30mm W X 2.00mm L X 0.90mm H body, IPC Medium Density; Part Description: Dual Bidirectional I2C Bus And SMBus Voltage-Level Translator; Manufacturer Part Number: PCA9306DCU; Pin Count: 8; Case: TSSOP8; Mounted: Yes; Socket: No; SMD: Yes; Sense: No; ComponentHeight: 0.9mm; Author: CERN DEM JLC; HelpURL: \\cern.ch\dfs\Applications\Altium\Datasheets\PCA9306DCUR.pdf; CreateDate: 25.02.2013; LatestRevisionDate: 19.03.2021
IC12 = PCA9539DB: Remote 16-Bit I2C and SMBus Low-Power I/O Expander With Interrupt Output, Reset, and Configuration Registers; Manufacturer: TEXAS INSTRUMENTS; PressFit: No; Bonding: No; Part Number: PCA9539DB; Component Kind: Standard; Component Type: Standard; Device: PCA9539DB; PackageDescription: SOP, 0.65mm Pitch; 24 pin, 5.30mm W X 8.20mm L X 2.00mm H body, IPC Medium Density; Part Description: Remote 16-Bit I2C and SMBus Low-Power I/O Expander with Interrupt Output, Reset, and Configuration Registers; Manufacturer Part Number: PCA9539DB; Pin Count: 24; Case: TSSOP24; Mounted: Yes; Socket: No; SMD: Yes; Sense: No; ComponentHeight: 2mm; Author: CERN DEM HF; HelpURL: \\cern.ch\dfs\Applications\Altium\Datasheets\PCA9539DB.pdf; CreateDate: 09.06.2022; LatestRevisionDate: 09.06.2022
IC13 = 24AA025E48-I/SN: 1.7V-5.5V, 2K I2C™ Serial EEPROMs with EUI-48™ Node Identity; Manufacturer: MICROCHIP TECHNOLOGY; PressFit: No; Bonding: No; Part Number: 24AA025E48-I/SN; Component Kind: Standard; Component Type: Standard; Device: 24AA025E48-I/SN; PackageDescription: SOIC 8, Pitch 1.27mm - Body 4x5mm, IPC Medium Density; Part Description: 1.7V-5.5V, 2K I2C™ Serial EEPROMs with EUI-48™ Node Identity; Manufacturer Part Number: 24AA025E48-I/SN; Pin Count: 8; Case: SOIC8; Mounted: Yes; Socket: No; SMD: Yes; Sense: No; ComponentHeight: 1.75mm; HelpURL: \\cern.ch\dfs\Applications\Altium\Datasheets\24AA025E48-I-SN.pdf; Author: CERN DEM MR; CreateDate: 19.07.2016; LatestRevisionDate: 19.07.2016
LD1 LD2 = LED_KINGBRIGHT_KPH-1608CGCK: LED Green 1C 2A; Part Description: SMD Green LED, Case 1.6mmX0.8mm(0603), 0.65mm Thickness; PressFit: No; Bonding: No; Manufacturer Part Number: KPH-1608CGCK; ComponentHeight: 0.65mm; HelpURL: \\cern.ch\dfs\Applications\Altium\Datasheets\LED_KINGBRIGHT_KPH-1608CGCK.pdf; Part Number: LED_KINGBRIGHT_KPH-1608CGCK; Component Kind: Standard; Component Type: Standard; Color: Green; PackageDescription: SMT Green LED, Case 0603, Body L 1.6 x W 0.8mm H 0.65mm; Manufacturer: KINGBRIGHT; Pin Count: 2; Mounted: Yes; Socket: No; SMD: Yes; Sense: No; Author: CERN DEM JLC; CreateDate: 03.07.2017; LatestRevisionDate: 03.07.2017
R23 = R0402_200K_1%_0.0625W_100PPM: Resistor - 1%; Part Description: General Purpose Thick Film Chip Resistor; Manufacturer: GENERIC; Manufacturer1 Part Number: 232270672004L; TC: ±100ppm/°C; PressFit: No; Part Number: R0402_200K_1%_0.0625W_100PPM; Component Kind: Standard; Component Type: Standard; Pin Count: 2; Value: 200k; Status: Not Recommended; Power: 0.0625W; Tolerance: ±1%; Manufacturer Part Number: R0402_200K_1%_0.0625W_100PPM; Case: 0402; Mounted: Yes; Sense: No; Socket: No; SMD: Yes; Manufacturer1 Example: YAGEO PHYCOMP; Manufacturer1 ComponentHeight: 0.4mm; HelpURL: \\cern.ch\dfs\Applications\Altium\Datasheets\R0402_Phycomp_RC0402.pdf; Author: CERN DEM JLC; CreateDate: 03.12.2007; LatestRevisionDate: 17.10.2012
R24-R27 R30 R36 R38 R40 R41 R43 = R0402_10K_1%_0.0625W_100PPM: Resistor - 1%; Part Description: General Purpose Thick Film Chip Resistor; Manufacturer: GENERIC; Manufacturer1 Part Number: 232270671003L; TC: ±100ppm/°C; PressFit: No; Part Number: R0402_10K_1%_0.0625W_100PPM; Component Kind: Standard; Component Type: Standard; Pin Count: 2; Value: 10k; Status: Not Recommended; Power: 0.0625W; Tolerance: ±1%; Manufacturer Part Number: R0402_10K_1%_0.0625W_100PPM; Case: 0402; Mounted: Yes; Sense: No; Socket: No; SMD: Yes; Manufacturer1 Example: YAGEO PHYCOMP; Manufacturer1 ComponentHeight: 0.4mm; HelpURL: \\cern.ch\dfs\Applications\Altium\Datasheets\R0402_Phycomp_RC0402.pdf; Author: CERN DEM JLC; CreateDate: 2007-12-03; LatestRevisionDate: 2012-10-17
R28 R29 R31 R32 = R0402_1K_1%_0.0625W_100PPM: Resistor - 1%; Part Description: General Purpose Thick Film Chip Resistor; Manufacturer: GENERIC; Manufacturer1 Part Number: 232270671002L; TC: ±100ppm/°C; PressFit: No; Part Number: R0402_1K_1%_0.0625W_100PPM; Component Kind: Standard; Component Type: Standard; Pin Count: 2; Value: 1k; Status: Not Recommended; Power: 0.0625W; Tolerance: ±1%; Manufacturer Part Number: R0402_1K_1%_0.0625W_100PPM; Case: 0402; Mounted: Yes; Sense: No; Socket: No; SMD: Yes; Manufacturer1 Example: YAGEO PHYCOMP; Manufacturer1 ComponentHeight: 0.4mm; HelpURL: \\cern.ch\dfs\Applications\Altium\Datasheets\R0402_Phycomp_RC0402.pdf; Author: CERN DEM JLC; CreateDate: 03.12.2007; LatestRevisionDate: 17.10.2012
R33-R35 R37 R39 R42 = R0402_33K_1%_0.0625W_100PPM: Resistor - 1%; Part Description: General Purpose Thick Film Chip Resistor; Manufacturer: GENERIC; Manufacturer1 Part Number: 232270673303L; TC: ±100ppm/°C; PressFit: No; Part Number: R0402_33K_1%_0.0625W_100PPM; Component Kind: Standard; Component Type: Standard; Pin Count: 2; Value: 33k; Status: Not Recommended; Power: 0.0625W; Manufacturer Part Number: R0402_33K_1%_0.0625W_100PPM; Case: 0402; Mounted: Yes; Sense: No; Socket: No; SMD: Yes; Manufacturer1 Example: YAGEO PHYCOMP; Manufacturer1 ComponentHeight: 0.4mm; HelpURL: \\cern.ch\dfs\Applications\Altium\Datasheets\R0402_Phycomp_RC0402.pdf; Author: CERN DEM JLC; CreateDate: 03.12.2007; LatestRevisionDate: 17.10.2012
SW1 = SW_OMRON_A6S-4102-H: 4 Ways SPST DIP Switch; Part Description: 4 Ways SPST DIP Switch, White Flat Actuator with Seal Tape, Contact Rating 25mA 24VDC; Manufacturer: OMRON; PressFit: No; Part Number: SW_OMRON_A6S-4102-H; Component Kind: Standard; Component Type: Standard; Pin Count: 8; PackageDescription: Pitch 2.54mm, Body 11.3x6.4mm, 4 Ways SPST Surface-Mounting DIP Switch, OMRON A6S-H; Family: Switch; Mounted: Yes; Socket: No; SMD: Yes; Sense: No; Status: None; Manufacturer Part Number: A6S-4102-H; ComponentHeight: 3.8mm; HelpURL: \\cern.ch\dfs\Applications\Altium\Datasheets\SW_OMRON_A6S-4102-H.pdf; Author: CERN DEM JMW; CreateDate: 25.09.2008; LatestRevisionDate: 25.09.2008
T2-T6 = BSH103: N-CHANNEL MOSFET WITH DIODE; Part Description: 30V 850mA N-Channel Enhancement Mode Field-Effect Transistor; Manufacturer: NEXPERIA; PressFit: No; Bonding: No; Part Number: BSH103; Component Kind: Standard; Component Type: Standard; Device: BSH103; PackageDescription: SOT23, 3 pin, Pitch 0.95mm - 1.3mm W X 2.9mm L X 1.1mm H, IPC Medium Density; Manufacturer Part Number: BSH103; Pin Count: 3; Case: SOT23-3; Mounted: Yes; Socket: No; SMD: Yes; Sense: No; ComponentHeight: 1.1mm; HelpURL: \\cern.ch\dfs\Applications\Altium\Datasheets\BSH103.pdf; Author: CERN DEM JLC; CreateDate: 16.03.2010; LatestRevisionDate: 20.06.2017; ClassName: Artix
TP3-TP8 = SMD_PAD_1.27X1.27MM: Part Description: 1.27mm x 1.27mm PCB Copper Area (SMD Test Point); Mounted: No; Part Number: SMD_PAD_1.27X1.27MM; Component Kind: Standard (No BOM); Component Type: Standard (No BOM); Pin Count: 1; Family: Test Point; Socket: No; SMD: No; Sense: No; Status: None; ComponentHeight: 0mm; HelpURL: Undefined; Author: CERN DEM JLC; CreateDate: 12.01.2008; LatestRevisionDate: 12.01.2008; PackageDescription: 1.27mm x 1.27mm PCB Copper Area (SMD Test Point)

## Sheet IDC_EXT_Connectors.SchDoc: DIOT_EEM_Adapter
size 420 x 297 mm; CheckedBy: -; DrawnBy: Marcin Kiepiela; Address1: Warsaw University of Technology; Address2: Nowowiejska 15/19 00-665 Warsaw; DocumentNumber: 4; SheetNumber: 4; SheetTotal: 6; EDA_Number: ARTIQ; Projet: ARTIQ/Sinara/DIOT; ModifiedBy: -; CheckedDate: -; Title2: -; DivGrp: ISE; Designer: Marcin Kiepiela; ModifiedDate: -; ProjectName: DIOT_EEM_Adapter.PrjPCB
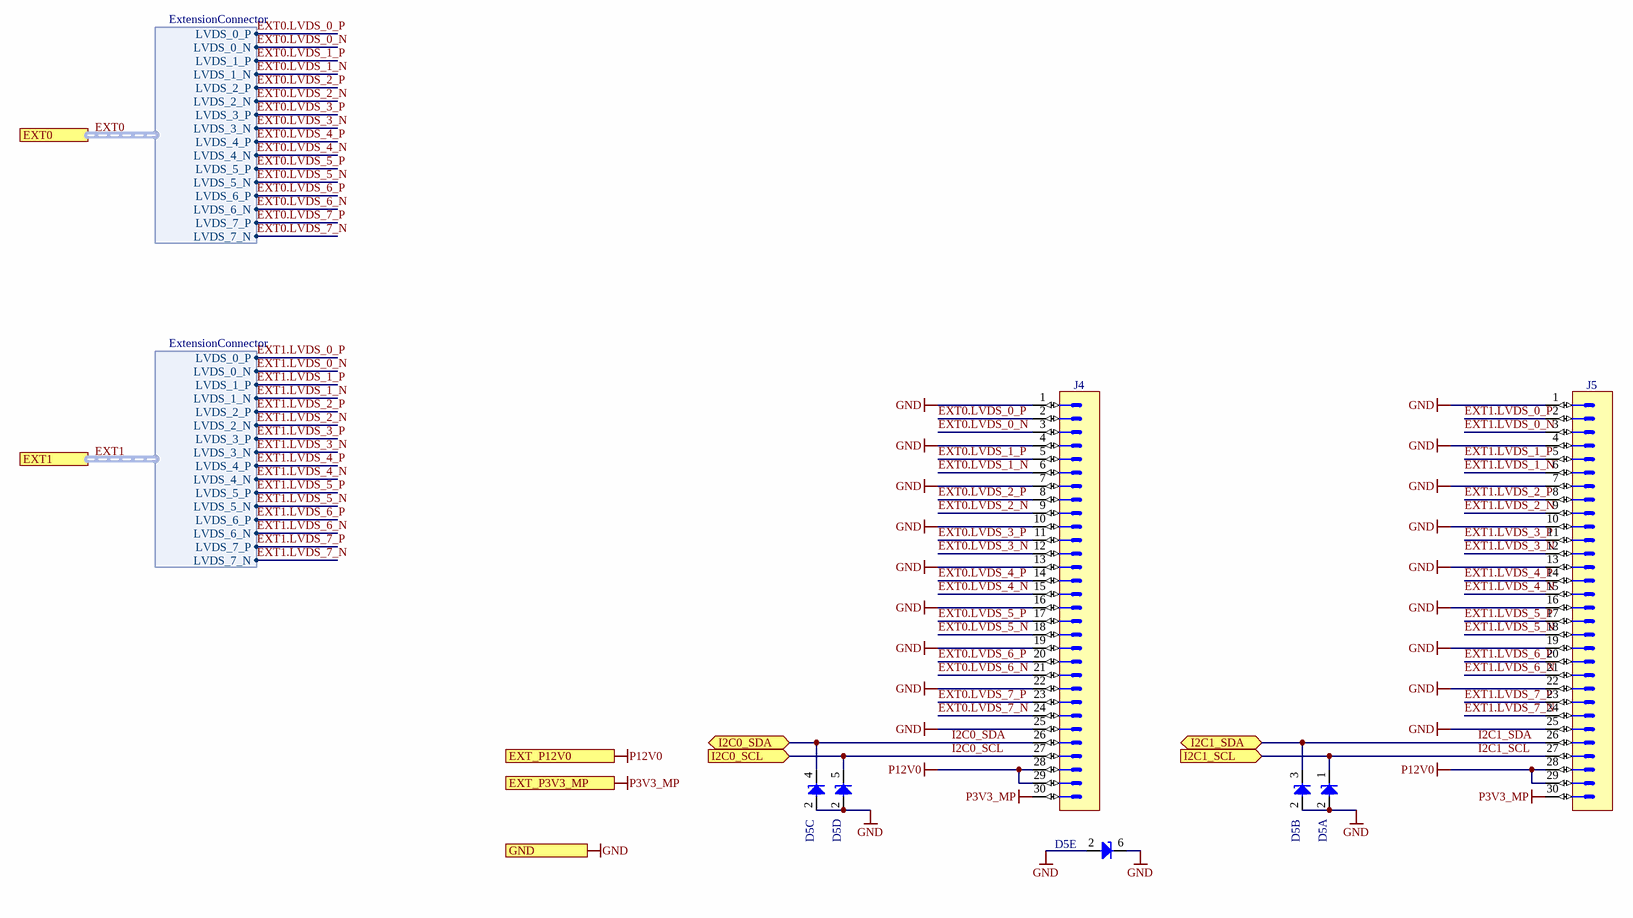
[diagram p2: IDC_EXT_Connectors.SchDoc]

### Parts
D5  PESD3V3L5UY  [SOT65P210X110-6N]  (value not drawn)  (parts A,B,C,D,E of 5)
J4  (no value)  [3M_N2530-6002RB]
J5  (no value)  [3M_N2530-6002RB]

### Ports
EXT0 (harness ExtensionConnector), EXT1 (harness ExtensionConnector), EXT_P3V3_MP (in), EXT_P12V0 (in), GND, I2C0_SCL (in), I2C0_SDA (bidir), I2C1_SCL (in), I2C1_SDA (bidir)

### Harnesses
ExtensionConnector: LVDS_0_N, LVDS_0_P, LVDS_1_N, LVDS_1_P, LVDS_2_N, LVDS_2_P, LVDS_3_N, LVDS_3_P, LVDS_4_N, LVDS_4_P, LVDS_5_N, LVDS_5_P, LVDS_6_N, LVDS_6_P, LVDS_7_N, LVDS_7_P

### Nets
GND: D5.2(A) D5.6(C) J4.1 J4.4 J4.7 J4.10 J4.13 J4.16 J4.19 J4.22 J4.25 J5.1 J5.4 J5.7 J5.10 J5.13 J5.16 J5.19 J5.22 J5.25 ; port GND
P3V3_MP: J4.30 J5.30 ; port EXT_P3V3_MP
P12V0: J4.28 J4.29 J5.28 J5.29 ; port EXT_P12V0  [project net EXT_P12V0]
EXT0.LVDS_0_N: J4.3 ; port EXT0.LVDS_0_N
EXT0.LVDS_0_P: J4.2 ; port EXT0.LVDS_0_P
EXT0.LVDS_1_N: J4.6 ; port EXT0.LVDS_1_N
EXT0.LVDS_1_P: J4.5 ; port EXT0.LVDS_1_P
EXT0.LVDS_2_N: J4.9 ; port EXT0.LVDS_2_N
EXT0.LVDS_2_P: J4.8 ; port EXT0.LVDS_2_P
EXT0.LVDS_3_N: J4.12 ; port EXT0.LVDS_3_N
EXT0.LVDS_3_P: J4.11 ; port EXT0.LVDS_3_P
EXT0.LVDS_4_N: J4.15 ; port EXT0.LVDS_4_N
EXT0.LVDS_4_P: J4.14 ; port EXT0.LVDS_4_P
EXT0.LVDS_5_N: J4.18 ; port EXT0.LVDS_5_N
EXT0.LVDS_5_P: J4.17 ; port EXT0.LVDS_5_P
EXT0.LVDS_6_N: J4.21 ; port EXT0.LVDS_6_N
EXT0.LVDS_6_P: J4.20 ; port EXT0.LVDS_6_P
EXT0.LVDS_7_N: J4.24 ; port EXT0.LVDS_7_N
EXT0.LVDS_7_P: J4.23 ; port EXT0.LVDS_7_P
EXT1.LVDS_0_N: J5.3 ; port EXT1.LVDS_0_N
EXT1.LVDS_0_P: J5.2 ; port EXT1.LVDS_0_P
EXT1.LVDS_1_N: J5.6 ; port EXT1.LVDS_1_N
EXT1.LVDS_1_P: J5.5 ; port EXT1.LVDS_1_P
EXT1.LVDS_2_N: J5.9 ; port EXT1.LVDS_2_N
EXT1.LVDS_2_P: J5.8 ; port EXT1.LVDS_2_P
EXT1.LVDS_3_N: J5.12 ; port EXT1.LVDS_3_N
EXT1.LVDS_3_P: J5.11 ; port EXT1.LVDS_3_P
EXT1.LVDS_4_N: J5.15 ; port EXT1.LVDS_4_N
EXT1.LVDS_4_P: J5.14 ; port EXT1.LVDS_4_P
EXT1.LVDS_5_N: J5.18 ; port EXT1.LVDS_5_N
EXT1.LVDS_5_P: J5.17 ; port EXT1.LVDS_5_P
EXT1.LVDS_6_N: J5.21 ; port EXT1.LVDS_6_N
EXT1.LVDS_6_P: J5.20 ; port EXT1.LVDS_6_P
EXT1.LVDS_7_N: J5.24 ; port EXT1.LVDS_7_N
EXT1.LVDS_7_P: J5.23 ; port EXT1.LVDS_7_P
I2C0_SCL: D5.5(C) J4.27 ; port I2C0_SCL
I2C0_SDA: D5.4(C) J4.26 ; port I2C0_SDA
I2C1_SCL: D5.1(C) J5.27 ; port I2C1_SCL
I2C1_SDA: D5.3(C) J5.26 ; port I2C1_SDA

### Buses and harness runs
harness EXT0 = port EXT0
harness EXT1 = port EXT1

### Notes on the sheet
- Project/Equipment
- Document
- Designer
- Drawn by
- Check.by
- Copyright WUT 2023.
  This document describes Open Hardware and is licensed under the CERN-OHL-W v2
  You may redistribute and modify this documentation and make products using it under the terms of the CERN-OHL-W v2 (https:/cern.ch/cern-ohl). This documentation is distributed WITHOUT ANY EXPRESS OR IMPLIED WARRANTY, INCLUDING OF MERCHANTABILITY, SATISFACTORY QUALITY AND FITNESS FOR A PARTICULAR PURPOSE. Please see the CERN-OHL-W v2 for applicable conditions.
  Source location: https://github.com/sinara-hw/EEM_FMC_Carrier
  As per CERN-OHL-W v2 section 4, should You produce hardware based on these sources, You must maintain the Source Location visible on the silkscreen or top copper for a EEM FMC Carrier PCB or other product you make using this documentation.
- Contact:
- File
- Last Mod.
- Print Date
- Sheet
- Size
- A3
- of
- Rev

### Library data of the parts
D5 = PESD3V3L5UY: Fivefold ESD Protection Diode Arrays; Part Description: Fivefold ESD Protection Diode Arrays (30kV); Manufacturer: NEXPERIA; Voltage: 3.3V; Power: 200W; PressFit: No; Bonding: No; Part Number: PESD3V3L5UY; Component Kind: Standard; Component Type: Standard; Device: PESD3V3L5UY; PackageDescription: SOT363, SC-88, 0.65mm Pitch; 6 Pin, 1.25mm W X 2.00mm L X 1.10mm H body, IPC Medium Density; Manufacturer Part Number: PESD3V3L5UY; Pin Count: 6; Case: SOT363; Mounted: Yes; Socket: No; SMD: Yes; Sense: No; ComponentHeight: 1.1mm; HelpURL: \\cern.ch\dfs\Applications\Altium\Datasheets\PESD3V3L5UY.pdf; Author: CERN DEM WB; CreateDate: 05.07.2021; LatestRevisionDate: 05.07.2021
J4 J5 = 3M_N2530-6002RB: Connector 30 Male; Part Description: 30 Contacts - Straight .100'' x .100'' Low Profile Four-Wall Header, 2500 Series; Manufacturer: 3M; PressFit: No; Part Number: 3M_N2530-6002RB; Component Kind: Standard; Component Type: Standard; Pin Count: 30; Family: Header 30; Mounted: Yes; Socket: No; SMD: No; Sense: No; Status: None; Manufacturer Part Number: N2530-6002RB; ComponentHeight: 10.03mm; HelpURL: \\cern.ch\dfs\Applications\Altium\Datasheets\3M_N2530-6002RB.pdf; Author: CERN DEM JLC; CreateDate: 11.02.2009; LatestRevisionDate: 11.08.2009